# Altium project Project Hydra - CAM.PrjPcb
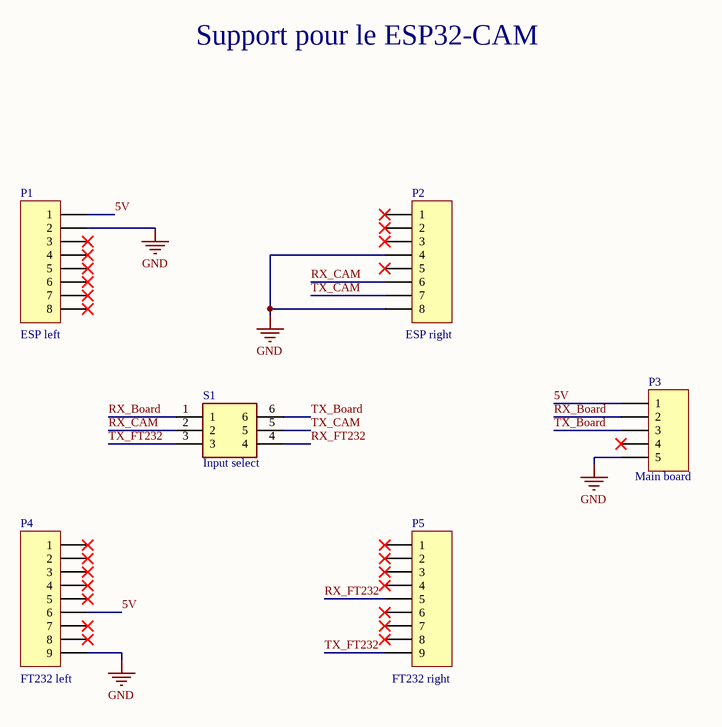
[diagram p0: Support ESP32-CAM.SchDoc]
1 sheet, 6 parts. Net scope: global (net labels, ports and power ports of the same name join across sheets).
Board file: Support ESP32-CAM.PcbDoc

## Sheet Support ESP32-CAM.SchDoc
size Letter; Organization: Cegep Limoilou; Address1: 1300, 8e Avenue; Address2: Québec, QC; Address3: Canada; Address4: G1J 5L5; Revision: Révision?; SheetNumber: ?; SheetTotal: ?; Conception: Conception?; Titre: Titre?; Modification: Modification?

### Parts
P1  Name: ESP left  [HDR1X8]  (hidden comment: Header 8)
P2  Name: ESP right  [HDR1X8]  (hidden comment: Header 8)
P3  Name: Main board  [HDR1X5]  (hidden comment: Header 5)
P4  Name: FT232 left  [HDR1X9]  (hidden comment: Header 9)
P5  Name: FT232 right  [HDR1X9]  (hidden comment: Header 9)
S1  Name: Input select  [DIP320W50P250L860H550Q6N]  (hidden comment: MHS222)

### Nets
GND: P1.2 P2.4 P2.8 P3.5 P4.9
5V: P1.1 P3.1 P4.6
RX_Board: P3.2 S1.1
RX_CAM: P2.6 S1.2
RX_FT232: P5.5 S1.4
TX_Board: P3.3 S1.6
TX_CAM: P2.7 S1.5
TX_FT232: P5.9 S1.3

Not connected (* = marked no-connect by the designer): P1 3* 4* 5* 6* 7* 8*; P2 1* 2* 3* 5*; P3 4*; P4 1* 2* 3* 4* 5* 7* 8*; P5 1* 2* 3* 4* 6* 7* 8*

### Notes on the sheet
- Support pour le ESP32-CAM
- Titre :
- Conception :
- Date :
- Modification :
- Heure :
- Révision :
- Feuille
- de
- Fichier :

### Library data of the parts
P1 P2 = Header 8: Header, 8-Pin; LatestRevisionDate: 17-Jul-2002; LatestRevisionNote: Re-released for DXP Platform.; Publisher: Altium Limited
P3 = Header 5: Header, 5-Pin; LatestRevisionDate: 17-Jul-2002; LatestRevisionNote: Re-released for DXP Platform.; Publisher: Altium Limited
P4 P5 = Header 9: Header, 9-Pin; LatestRevisionDate: 17-Jul-2002; LatestRevisionNote: Re-released for DXP Platform.; Publisher: Altium Limited
S1 = MHS222: Switch; Manufacturer_Name: Fujisoku; Datasheet Link: http://docs-asia.electrocomponents.com/webdocs/0fe8/0900766b80fe862b.pdf; Height: 3.5mm; Manufacturer_Part_Number: MHS222